# Altium schematic sheet CABLE_JIG_TEST_SCH.SchDoc
size 889 x 635 mm; SheetNumber: 1; SheetTotal: 1
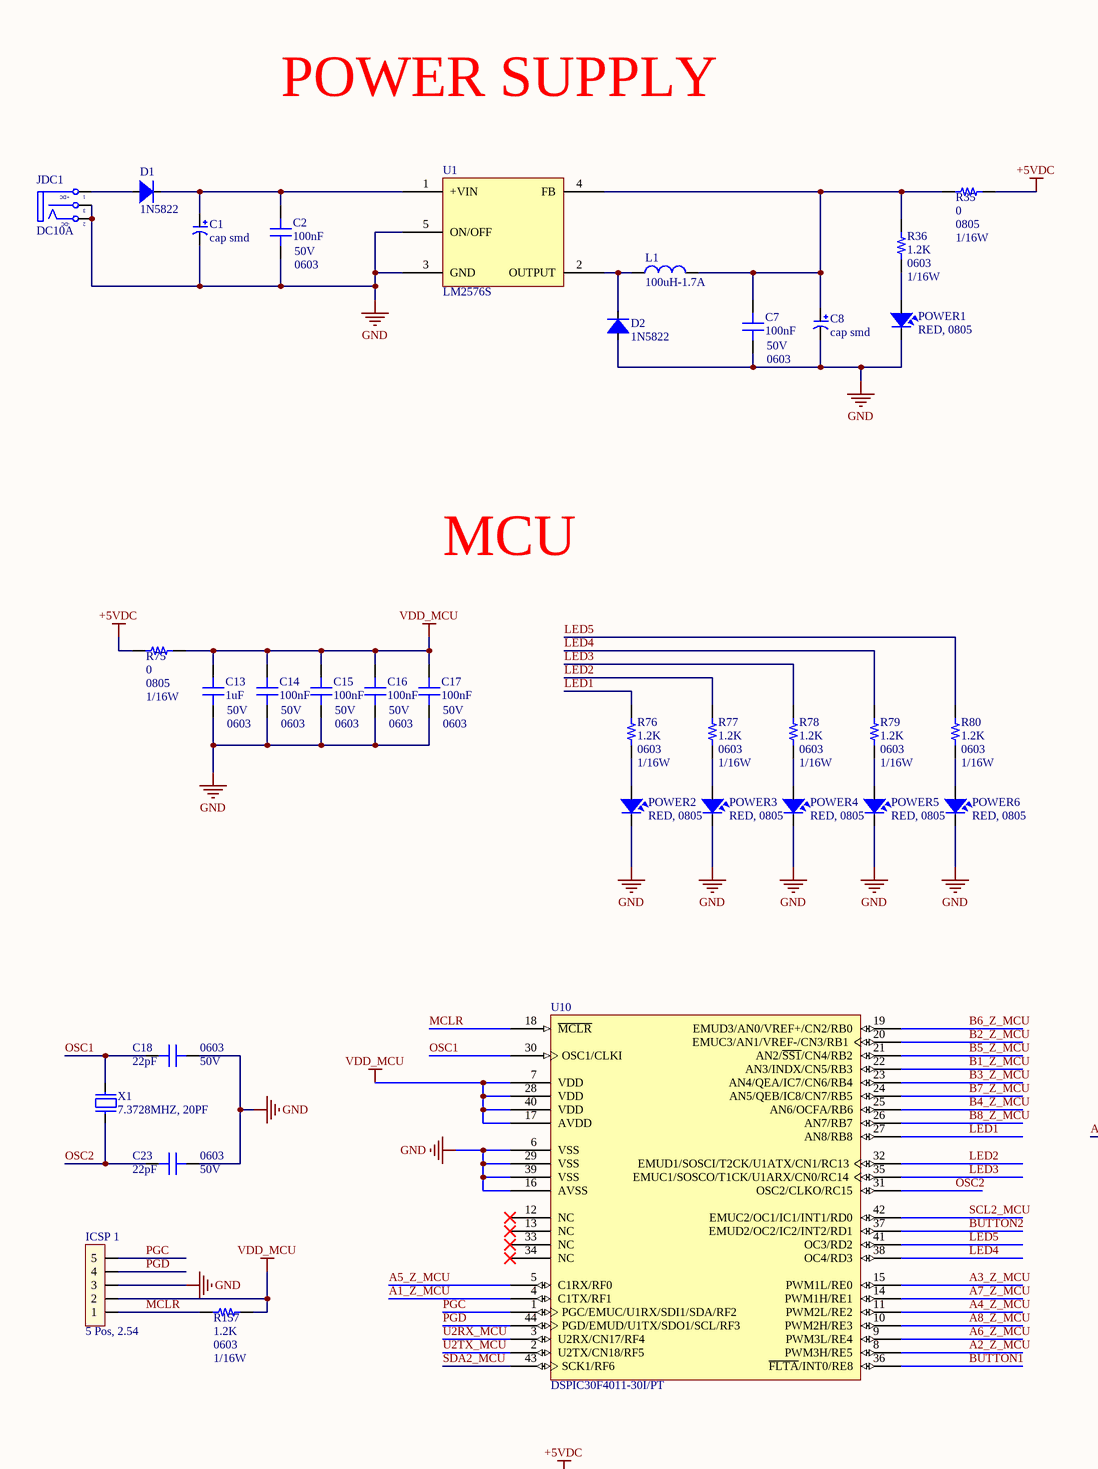
[diagram p0: CABLE_JIG_TEST_SCH.SchDoc, top left]
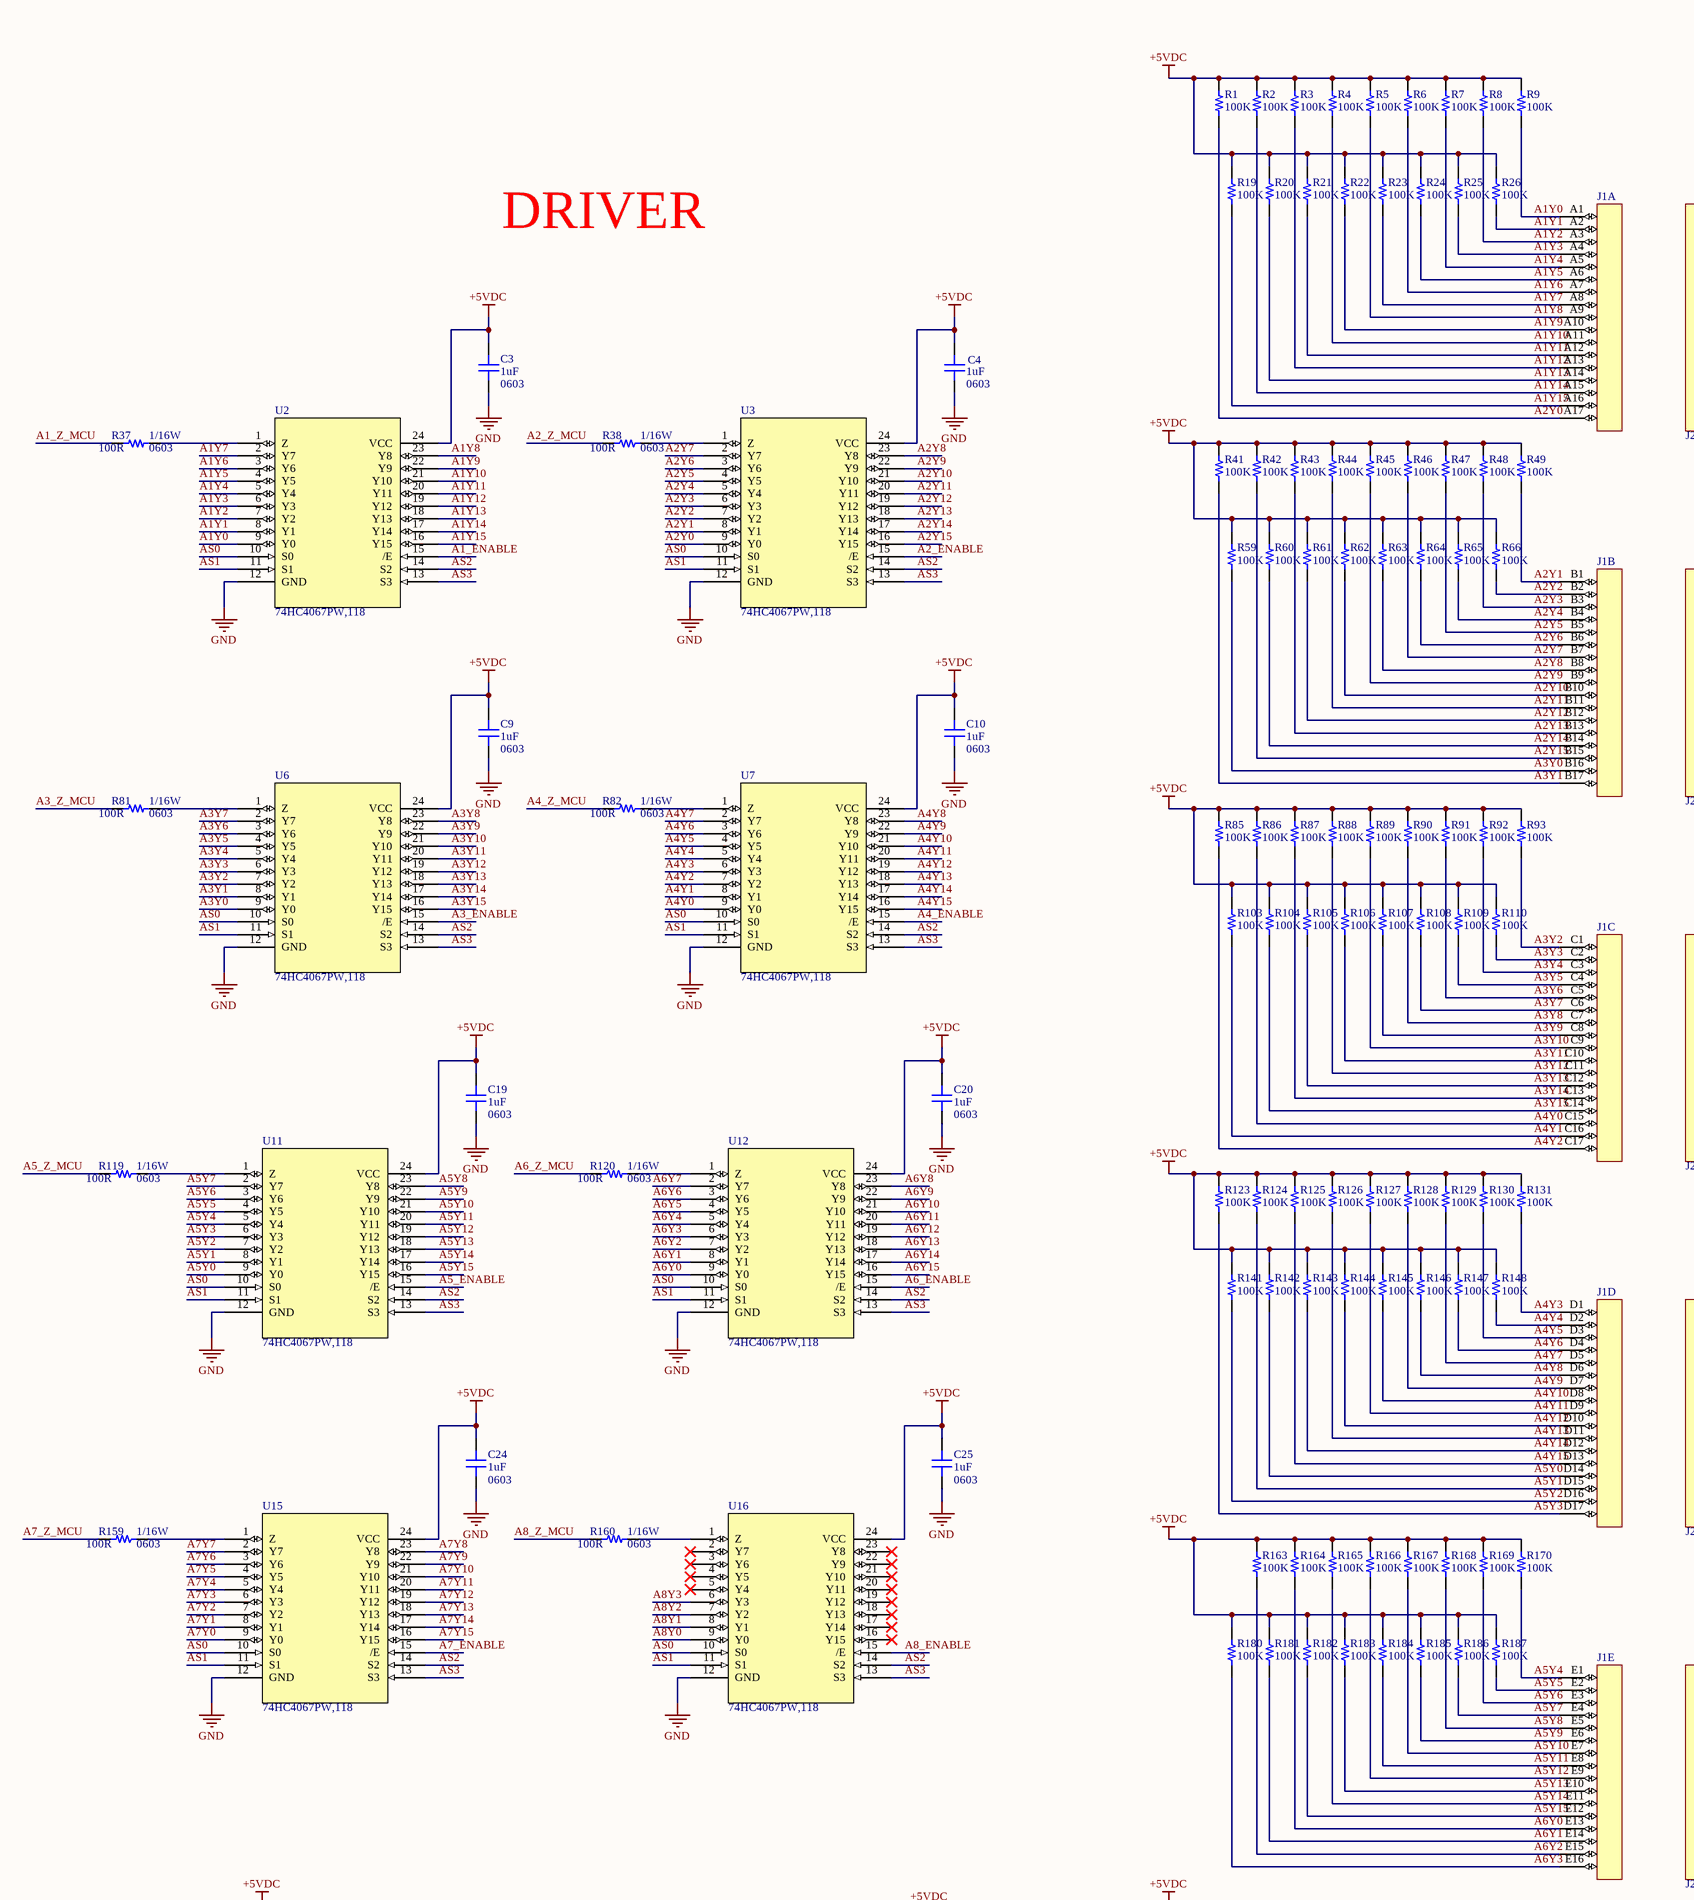
[diagram p1: CABLE_JIG_TEST_SCH.SchDoc, top middle]
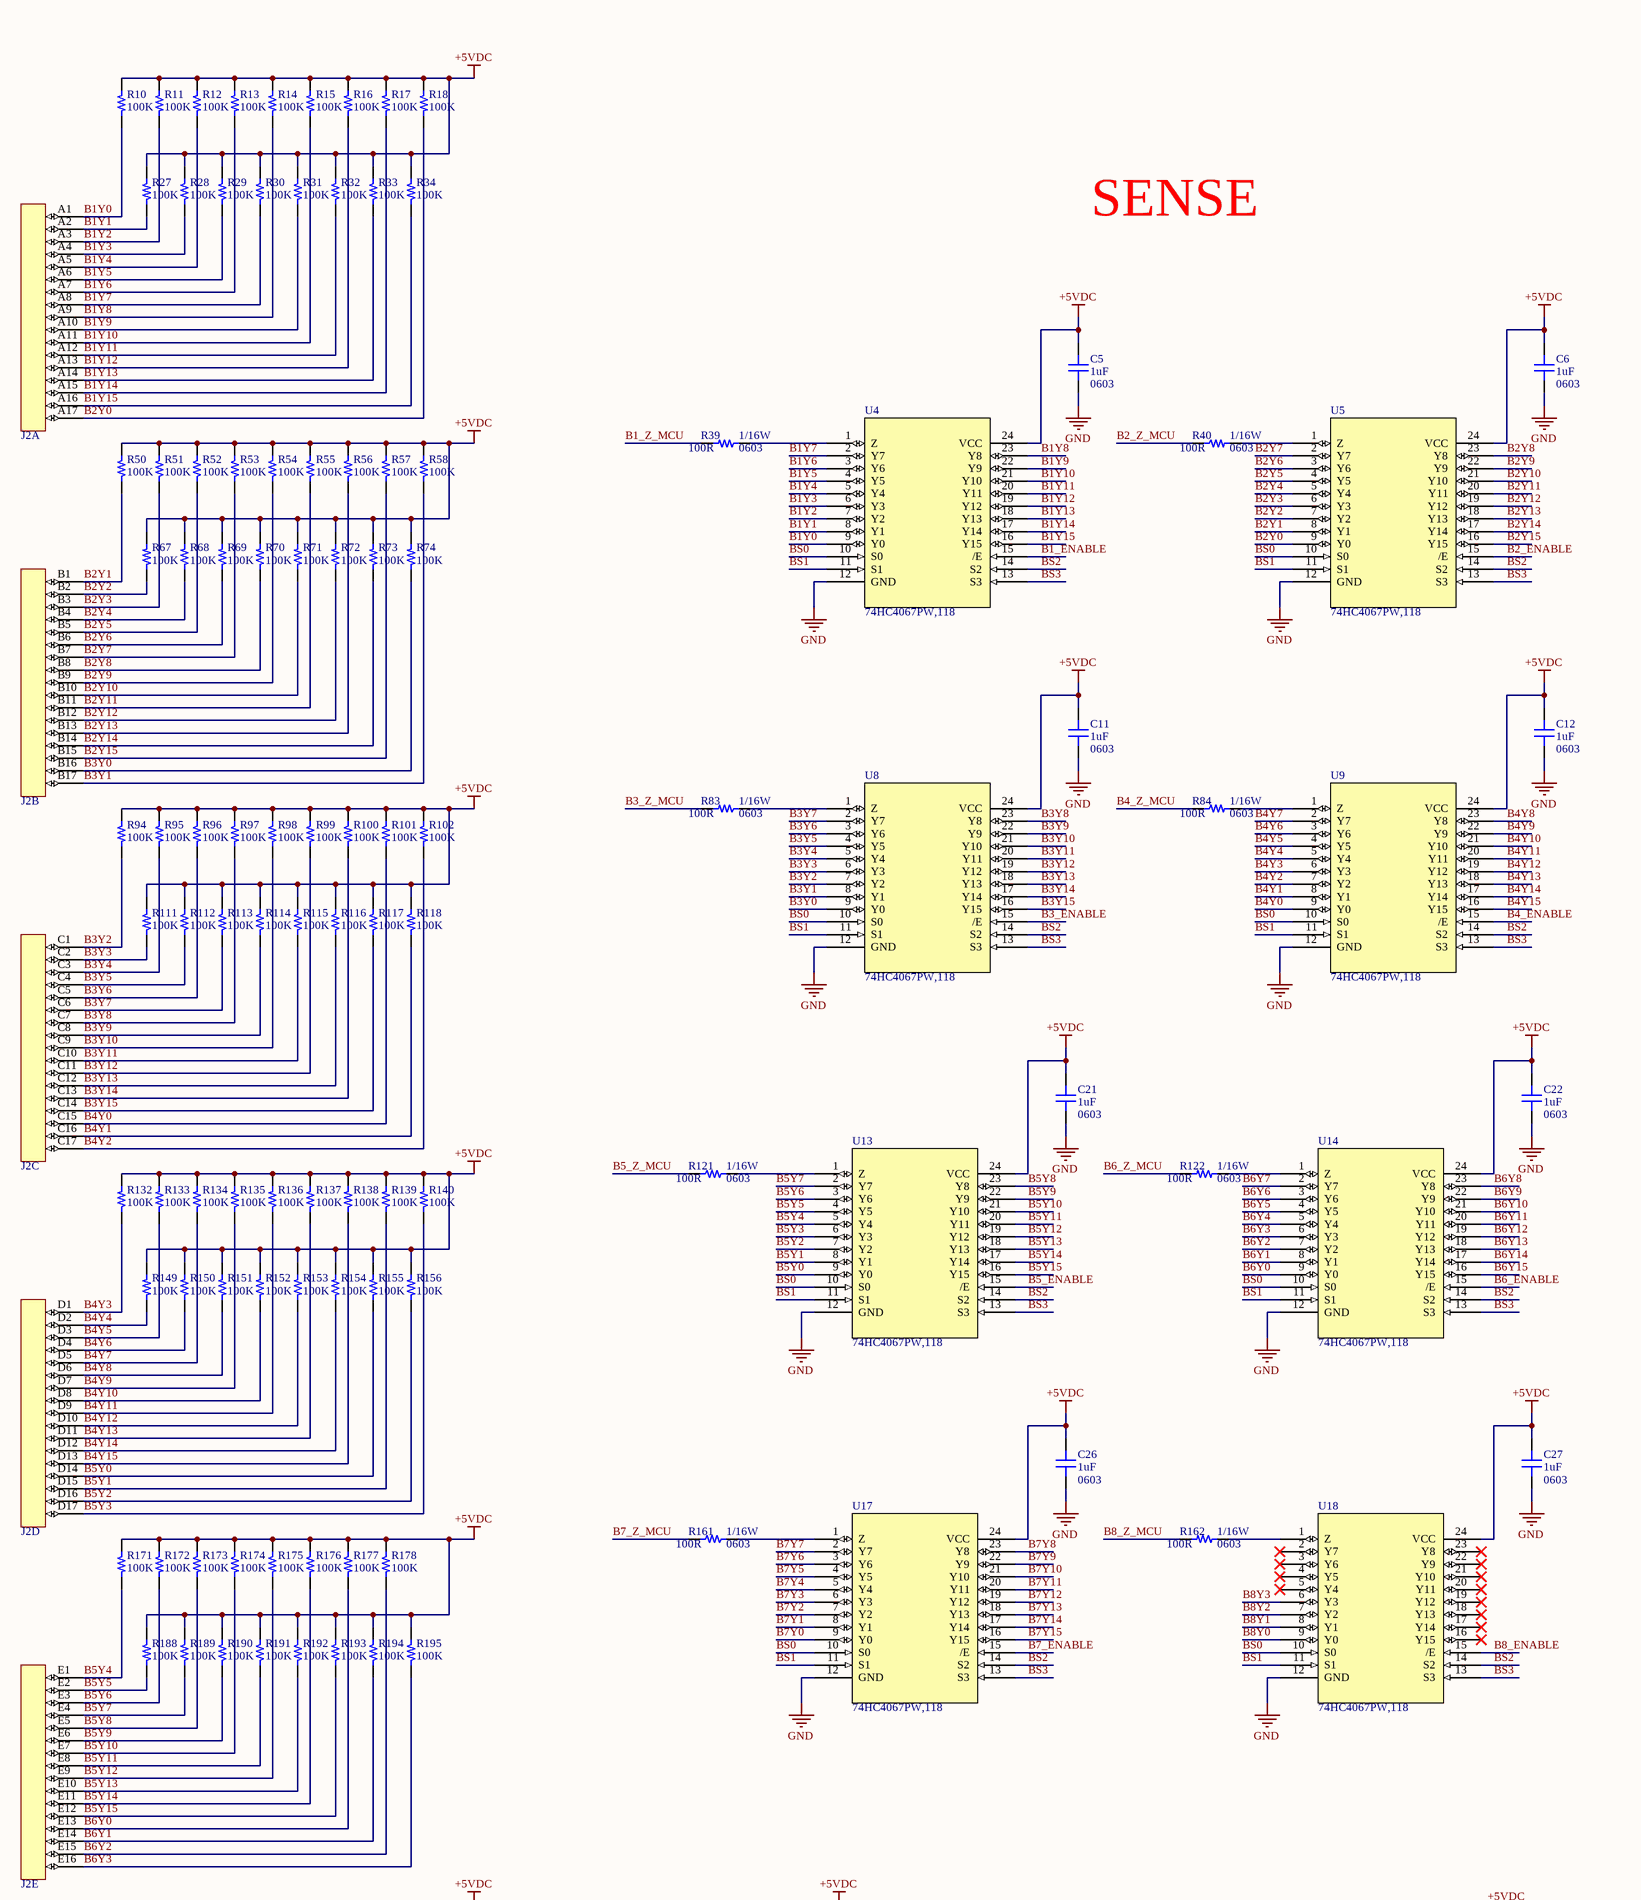
[diagram p2: CABLE_JIG_TEST_SCH.SchDoc, top right]
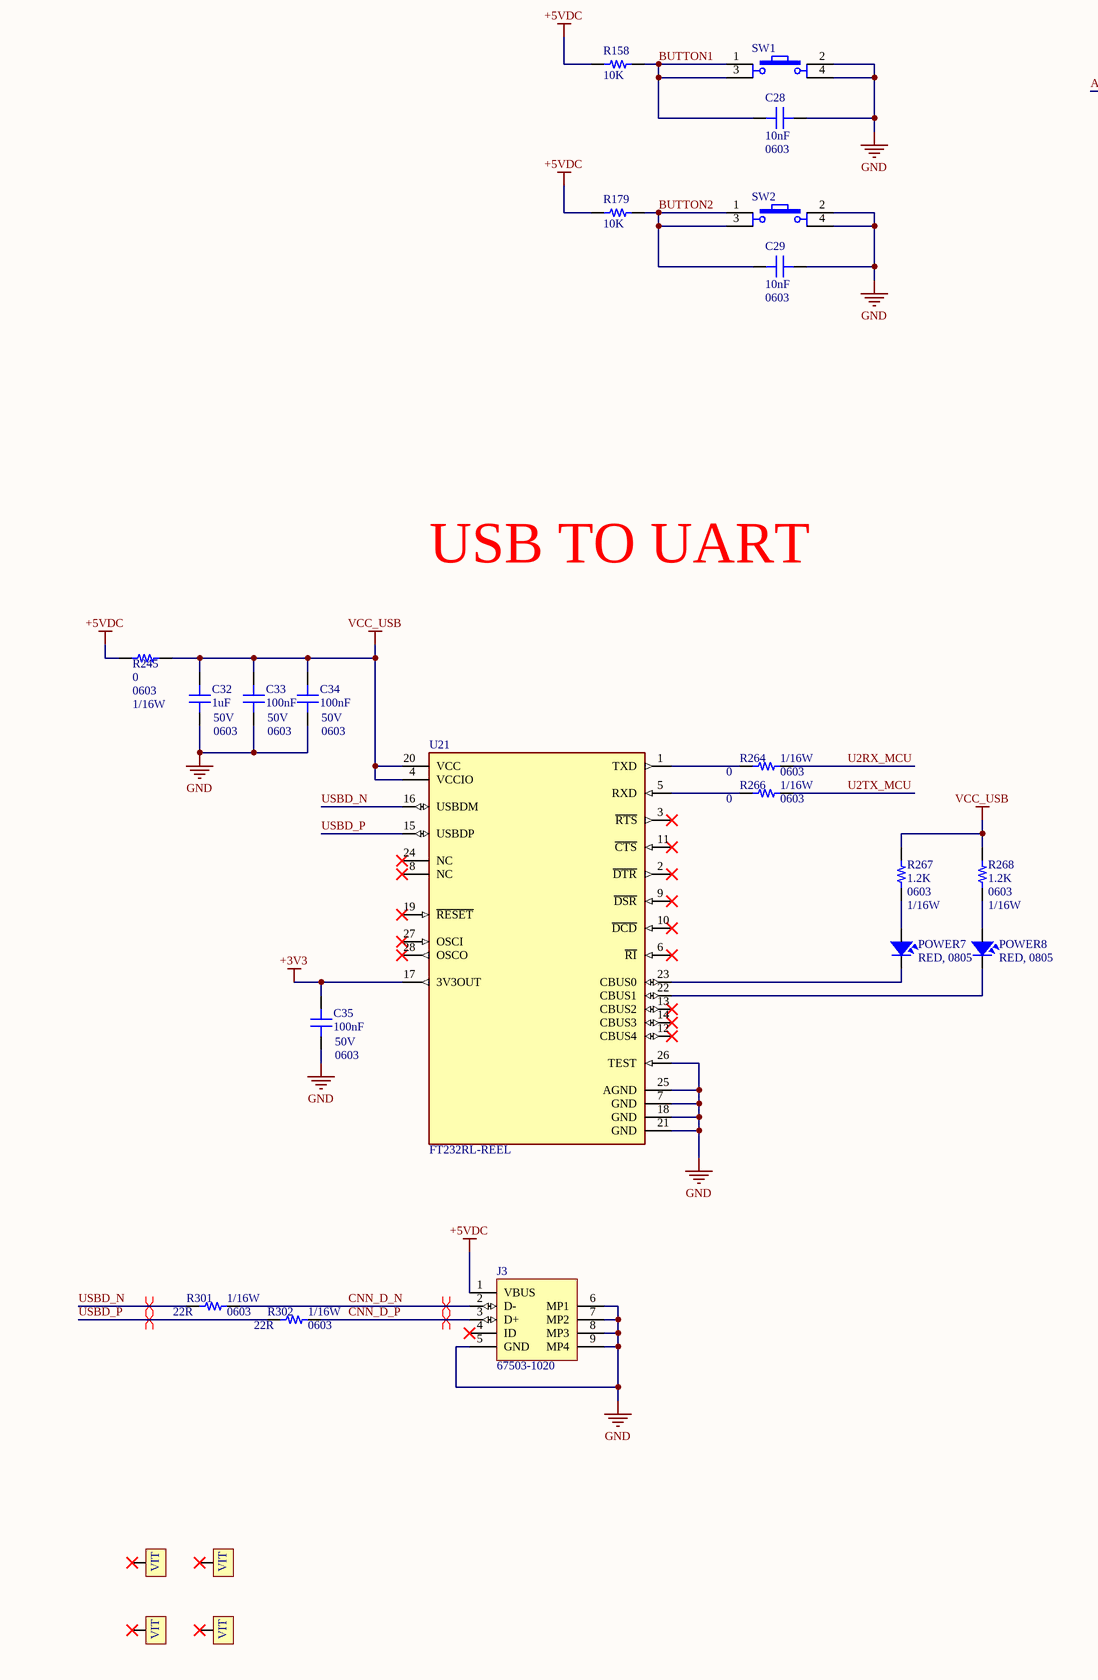
[diagram p3: CABLE_JIG_TEST_SCH.SchDoc, bottom left]
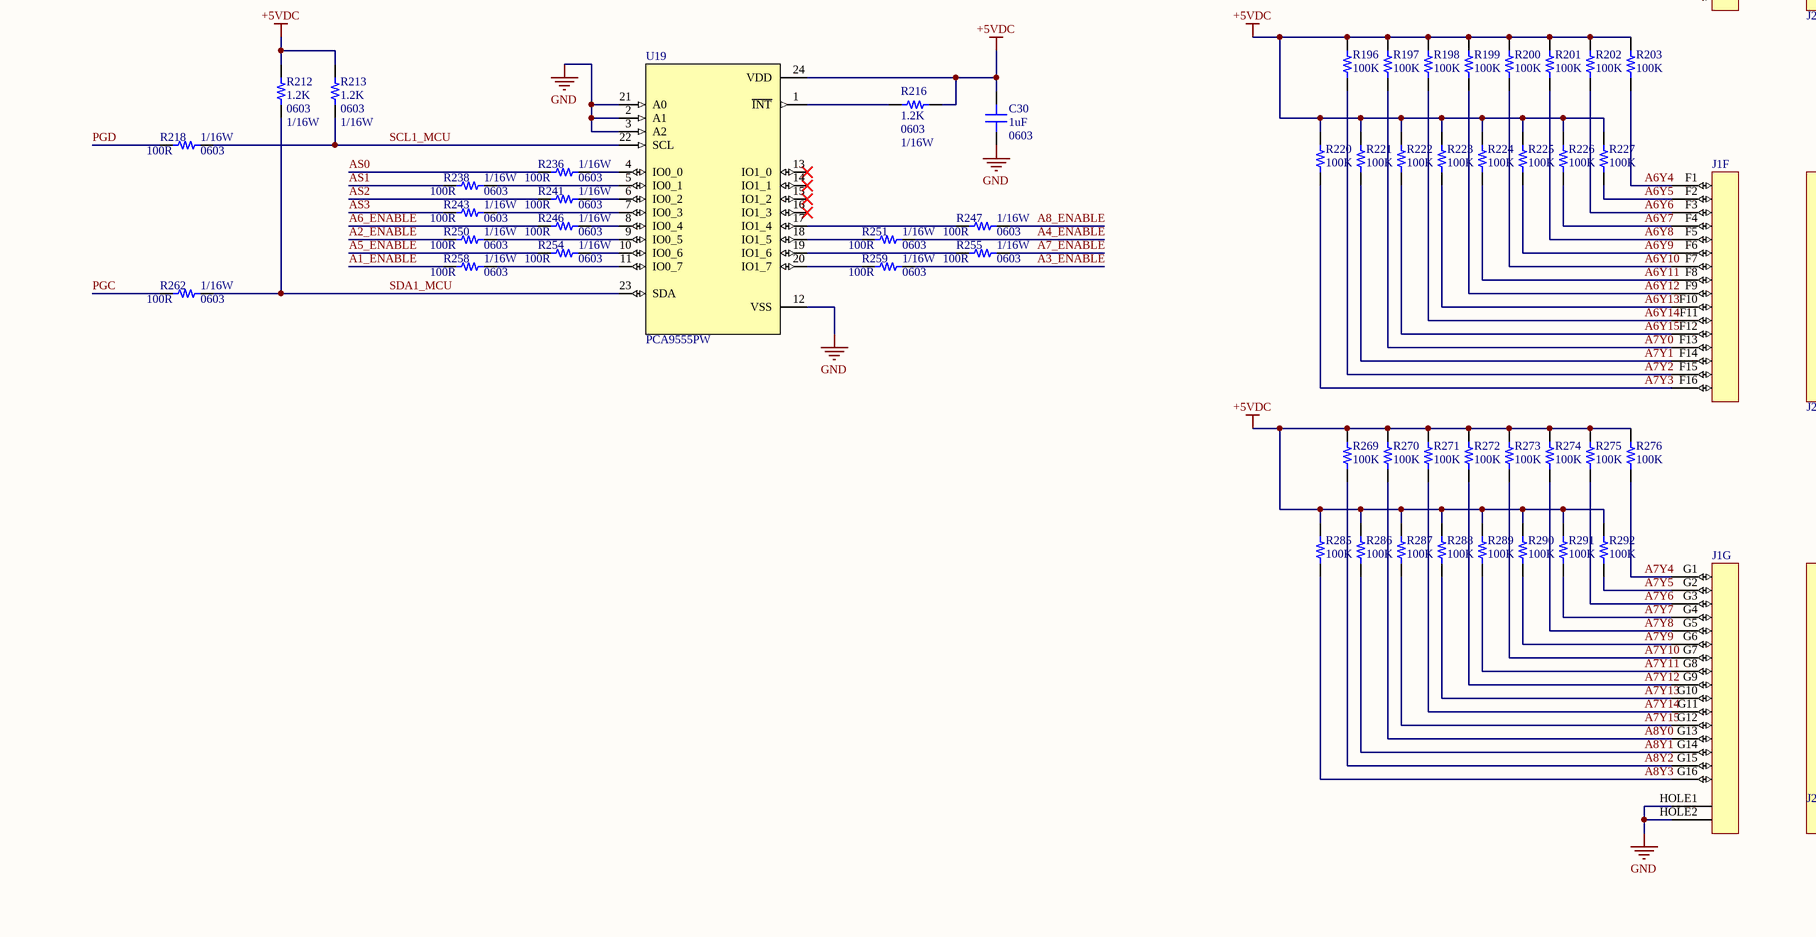
[diagram p4: CABLE_JIG_TEST_SCH.SchDoc, bottom middle]
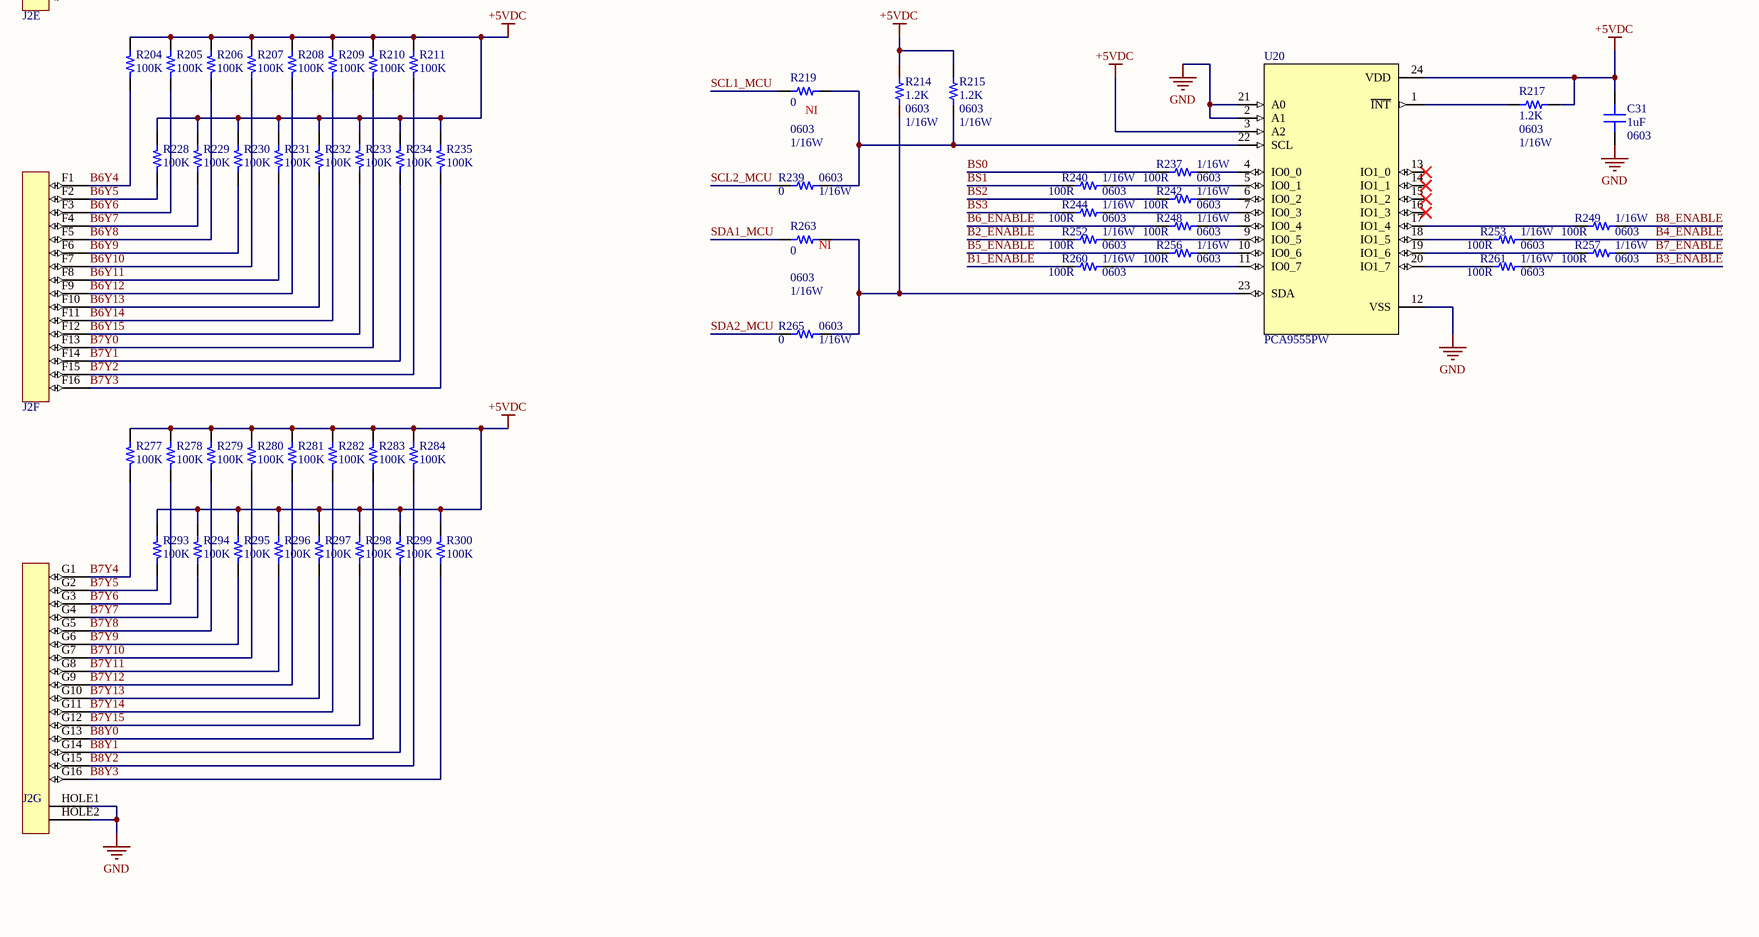
[diagram p5: CABLE_JIG_TEST_SCH.SchDoc, bottom right]

## Parts
C1  cap smd  [Cap_SMD_10x10.5mm]
C2  100nF  Package: 0603  Voltage: 50V  [C0603N]
C3  1uF  Package: 0603  [C0603N]
C4  1uF  Package: 0603  [C0603N]
C5  1uF  Package: 0603  [C0603N]
C6  1uF  Package: 0603  [C0603N]
C7  100nF  Package: 0603  Voltage: 50V  [C0603N]
C8  cap smd  [Cap_SMD_10x10.5mm]
C9  1uF  Package: 0603  [C0603N]
C10  1uF  Package: 0603  [C0603N]
C11  1uF  Package: 0603  [C0603N]
C12  1uF  Package: 0603  [C0603N]
C13  1uF  Package: 0603  Voltage: 50V  [C0603N]
C14  100nF  Package: 0603  Voltage: 50V  [C0603N]
C15  100nF  Package: 0603  Voltage: 50V  [C0603N]
C16  100nF  Package: 0603  Voltage: 50V  [C0603N]
C17  100nF  Package: 0603  Voltage: 50V  [C0603N]
C18  22pF  Package: 0603  Voltage: 50V  [C0603N]
C19  1uF  Package: 0603  [C0603N]
C20  1uF  Package: 0603  [C0603N]
C21  1uF  Package: 0603  [C0603N]
C22  1uF  Package: 0603  [C0603N]
C23  22pF  Package: 0603  Voltage: 50V  [C0603N]
C24  1uF  Package: 0603  [C0603N]
C25  1uF  Package: 0603  [C0603N]
C26  1uF  Package: 0603  [C0603N]
C27  1uF  Package: 0603  [C0603N]
C28  10nF  Package: 0603  [C0603N]
C29  10nF  Package: 0603  [C0603N]
C30  1uF  Package: 0603  [C0603N]
C31  1uF  Package: 0603  [C0603N]
C32  1uF  Package: 0603  Voltage: 50V  [C0603N]
C33  100nF  Package: 0603  Voltage: 50V  [C0603N]
C34  100nF  Package: 0603  Voltage: 50V  [C0603N]
C35  100nF  Package: 0603  Voltage: 50V  [C0603N]
D1  1N5822  [DO214 SMA]
D2  1N5822  [DO214 SMA]
ICSP_1  5 Pos, 2.54  [JP5]
J1  CNN_CABLE_116PINS  [CNN_CABLE_116PINS]  (value not drawn)  (parts A,B,C,D,E,F,G of 7)
J2  CNN_CABLE_116PINS  [CNN_CABLE_116PINS]  (value not drawn)  (parts A,B,C,D,E,F,G of 7)
J3  67503-1020  [MOLX-67503-1020_V]
JDC1  DC10A  [DC-IN]
L1  100uH-1.7A  [IND_SMD_12.5x12.5]
POWER1  RED, 0805  [LED 0805]
POWER2  RED, 0805  [LED 0805]
POWER3  RED, 0805  [LED 0805]
POWER4  RED, 0805  [LED 0805]
POWER5  RED, 0805  [LED 0805]
POWER6  RED, 0805  [LED 0805]
POWER7  RED, 0805  [LED 0805]
POWER8  RED, 0805  [LED 0805]
R1  100K  [R0603N]
R2  100K  [R0603N]
R3  100K  [R0603N]
R4  100K  [R0603N]
R5  100K  [R0603N]
R6  100K  [R0603N]
R7  100K  [R0603N]
R8  100K  [R0603N]
R9  100K  [R0603N]
R10  100K  [R0603N]
R11  100K  [R0603N]
R12  100K  [R0603N]
R13  100K  [R0603N]
R14  100K  [R0603N]
R15  100K  [R0603N]
R16  100K  [R0603N]
R17  100K  [R0603N]
R18  100K  [R0603N]
R19  100K  [R0603N]
R20  100K  [R0603N]
R21  100K  [R0603N]
R22  100K  [R0603N]
R23  100K  [R0603N]
R24  100K  [R0603N]
R25  100K  [R0603N]
R26  100K  [R0603N]
R27  100K  [R0603N]
R28  100K  [R0603N]
R29  100K  [R0603N]
R30  100K  [R0603N]
R31  100K  [R0603N]
R32  100K  [R0603N]
R33  100K  [R0603N]
R34  100K  [R0603N]
R35  0  Package: 0805  Power Rating: 1/16W  [R0805N]
R36  1.2K  Package: 0603  Power Rating: 1/16W  [R0603N]
R37  100R  Package: 0603  Power Rating: 1/16W  [R0603N]
R38  100R  Package: 0603  Power Rating: 1/16W  [R0603N]
R39  100R  Package: 0603  Power Rating: 1/16W  [R0603N]
R40  100R  Package: 0603  Power Rating: 1/16W  [R0603N]
R41  100K  [R0603N]
R42  100K  [R0603N]
R43  100K  [R0603N]
R44  100K  [R0603N]
R45  100K  [R0603N]
R46  100K  [R0603N]
R47  100K  [R0603N]
R48  100K  [R0603N]
R49  100K  [R0603N]
R50  100K  [R0603N]
R51  100K  [R0603N]
R52  100K  [R0603N]
R53  100K  [R0603N]
R54  100K  [R0603N]
R55  100K  [R0603N]
R56  100K  [R0603N]
R57  100K  [R0603N]
R58  100K  [R0603N]
R59  100K  [R0603N]
R60  100K  [R0603N]
R61  100K  [R0603N]
R62  100K  [R0603N]
R63  100K  [R0603N]
R64  100K  [R0603N]
R65  100K  [R0603N]
R66  100K  [R0603N]
R67  100K  [R0603N]
R68  100K  [R0603N]
R69  100K  [R0603N]
R70  100K  [R0603N]
R71  100K  [R0603N]
R72  100K  [R0603N]
R73  100K  [R0603N]
R74  100K  [R0603N]
R75  0  Package: 0805  Power Rating: 1/16W  [R0805N]
R76  1.2K  Package: 0603  Power Rating: 1/16W  [R0603N]
R77  1.2K  Package: 0603  Power Rating: 1/16W  [R0603N]
R78  1.2K  Package: 0603  Power Rating: 1/16W  [R0603N]
R79  1.2K  Package: 0603  Power Rating: 1/16W  [R0603N]
R80  1.2K  Package: 0603  Power Rating: 1/16W  [R0603N]
R81  100R  Package: 0603  Power Rating: 1/16W  [R0603N]
R82  100R  Package: 0603  Power Rating: 1/16W  [R0603N]
R83  100R  Package: 0603  Power Rating: 1/16W  [R0603N]
R84  100R  Package: 0603  Power Rating: 1/16W  [R0603N]
R85  100K  [R0603N]
R86  100K  [R0603N]
R87  100K  [R0603N]
R88  100K  [R0603N]
R89  100K  [R0603N]
R90  100K  [R0603N]
R91  100K  [R0603N]
R92  100K  [R0603N]
R93  100K  [R0603N]
R94  100K  [R0603N]
R95  100K  [R0603N]
R96  100K  [R0603N]
R97  100K  [R0603N]
R98  100K  [R0603N]
R99  100K  [R0603N]
R100  100K  [R0603N]
R101  100K  [R0603N]
R102  100K  [R0603N]
R103  100K  [R0603N]
R104  100K  [R0603N]
R105  100K  [R0603N]
R106  100K  [R0603N]
R107  100K  [R0603N]
R108  100K  [R0603N]
R109  100K  [R0603N]
R110  100K  [R0603N]
R111  100K  [R0603N]
R112  100K  [R0603N]
R113  100K  [R0603N]
R114  100K  [R0603N]
R115  100K  [R0603N]
R116  100K  [R0603N]
R117  100K  [R0603N]
R118  100K  [R0603N]
R119  100R  Package: 0603  Power Rating: 1/16W  [R0603N]
R120  100R  Package: 0603  Power Rating: 1/16W  [R0603N]
R121  100R  Package: 0603  Power Rating: 1/16W  [R0603N]
R122  100R  Package: 0603  Power Rating: 1/16W  [R0603N]
R123  100K  [R0603N]
R124  100K  [R0603N]
R125  100K  [R0603N]
R126  100K  [R0603N]
R127  100K  [R0603N]
R128  100K  [R0603N]
R129  100K  [R0603N]
R130  100K  [R0603N]
R131  100K  [R0603N]
R132  100K  [R0603N]
R133  100K  [R0603N]
R134  100K  [R0603N]
R135  100K  [R0603N]
R136  100K  [R0603N]
R137  100K  [R0603N]
R138  100K  [R0603N]
R139  100K  [R0603N]
R140  100K  [R0603N]
R141  100K  [R0603N]
R142  100K  [R0603N]
R143  100K  [R0603N]
R144  100K  [R0603N]
R145  100K  [R0603N]
R146  100K  [R0603N]
R147  100K  [R0603N]
R148  100K  [R0603N]
R149  100K  [R0603N]
R150  100K  [R0603N]
R151  100K  [R0603N]
R152  100K  [R0603N]
R153  100K  [R0603N]
R154  100K  [R0603N]
R155  100K  [R0603N]
R156  100K  [R0603N]
R157  1.2K  Package: 0603  Power Rating: 1/16W  [R0603N]
R158  10K  [R0603N]
R159  100R  Package: 0603  Power Rating: 1/16W  [R0603N]
R160  100R  Package: 0603  Power Rating: 1/16W  [R0603N]
R161  100R  Package: 0603  Power Rating: 1/16W  [R0603N]
R162  100R  Package: 0603  Power Rating: 1/16W  [R0603N]
R163  100K  [R0603N]
R164  100K  [R0603N]
R165  100K  [R0603N]
R166  100K  [R0603N]
R167  100K  [R0603N]
R168  100K  [R0603N]
R169  100K  [R0603N]
R170  100K  [R0603N]
R171  100K  [R0603N]
R172  100K  [R0603N]
R173  100K  [R0603N]
R174  100K  [R0603N]
R175  100K  [R0603N]
R176  100K  [R0603N]
R177  100K  [R0603N]
R178  100K  [R0603N]
R179  10K  [R0603N]
R180  100K  [R0603N]
R181  100K  [R0603N]
R182  100K  [R0603N]
R183  100K  [R0603N]
R184  100K  [R0603N]
R185  100K  [R0603N]
R186  100K  [R0603N]
R187  100K  [R0603N]
R188  100K  [R0603N]
R189  100K  [R0603N]
R190  100K  [R0603N]
R191  100K  [R0603N]
R192  100K  [R0603N]
R193  100K  [R0603N]
R194  100K  [R0603N]
R195  100K  [R0603N]
R196  100K  [R0603N]
R197  100K  [R0603N]
R198  100K  [R0603N]
R199  100K  [R0603N]
R200  100K  [R0603N]
R201  100K  [R0603N]
R202  100K  [R0603N]
R203  100K  [R0603N]
R204  100K  [R0603N]
R205  100K  [R0603N]
R206  100K  [R0603N]
R207  100K  [R0603N]
R208  100K  [R0603N]
R209  100K  [R0603N]
R210  100K  [R0603N]
R211  100K  [R0603N]
R212  1.2K  Package: 0603  Power Rating: 1/16W  [R0603N]
R213  1.2K  Package: 0603  Power Rating: 1/16W  [R0603N]
R214  1.2K  Package: 0603  Power Rating: 1/16W  [R0603N]
R215  1.2K  Package: 0603  Power Rating: 1/16W  [R0603N]
R216  1.2K  Package: 0603  Power Rating: 1/16W  [R0603N]
R217  1.2K  Package: 0603  Power Rating: 1/16W  [R0603N]
R218  100R  Package: 0603  Power Rating: 1/16W  [R0603N]
R219  0  NI_MARK: NI  Package: 0603  Power Rating: 1/16W  [R0603N]
R220  100K  [R0603N]
R221  100K  [R0603N]
R222  100K  [R0603N]
R223  100K  [R0603N]
R224  100K  [R0603N]
R225  100K  [R0603N]
R226  100K  [R0603N]
R227  100K  [R0603N]
R228  100K  [R0603N]
R229  100K  [R0603N]
R230  100K  [R0603N]
R231  100K  [R0603N]
R232  100K  [R0603N]
R233  100K  [R0603N]
R234  100K  [R0603N]
R235  100K  [R0603N]
R236  100R  Package: 0603  Power Rating: 1/16W  [R0603N]
R237  100R  Package: 0603  Power Rating: 1/16W  [R0603N]
R238  100R  Package: 0603  Power Rating: 1/16W  [R0603N]
R239  0  Package: 0603  Power Rating: 1/16W  [R0603N]
R240  100R  Package: 0603  Power Rating: 1/16W  [R0603N]
R241  100R  Package: 0603  Power Rating: 1/16W  [R0603N]
R242  100R  Package: 0603  Power Rating: 1/16W  [R0603N]
R243  100R  Package: 0603  Power Rating: 1/16W  [R0603N]
R244  100R  Package: 0603  Power Rating: 1/16W  [R0603N]
R245  0  Package: 0603  Power Rating: 1/16W  [R0603N]
R246  100R  Package: 0603  Power Rating: 1/16W  [R0603N]
R247  100R  Package: 0603  Power Rating: 1/16W  [R0603N]
R248  100R  Package: 0603  Power Rating: 1/16W  [R0603N]
R249  100R  Package: 0603  Power Rating: 1/16W  [R0603N]
R250  100R  Package: 0603  Power Rating: 1/16W  [R0603N]
R251  100R  Package: 0603  Power Rating: 1/16W  [R0603N]
R252  100R  Package: 0603  Power Rating: 1/16W  [R0603N]
R253  100R  Package: 0603  Power Rating: 1/16W  [R0603N]
R254  100R  Package: 0603  Power Rating: 1/16W  [R0603N]
R255  100R  Package: 0603  Power Rating: 1/16W  [R0603N]
R256  100R  Package: 0603  Power Rating: 1/16W  [R0603N]
R257  100R  Package: 0603  Power Rating: 1/16W  [R0603N]
R258  100R  Package: 0603  Power Rating: 1/16W  [R0603N]
R259  100R  Package: 0603  Power Rating: 1/16W  [R0603N]
R260  100R  Package: 0603  Power Rating: 1/16W  [R0603N]
R261  100R  Package: 0603  Power Rating: 1/16W  [R0603N]
R262  100R  Package: 0603  Power Rating: 1/16W  [R0603N]
R263  0  NI_MARK: NI  Package: 0603  Power Rating: 1/16W  [R0603N]
R264  0  Package: 0603  Power Rating: 1/16W  [R0603N]
R265  0  Package: 0603  Power Rating: 1/16W  [R0603N]
R266  0  Package: 0603  Power Rating: 1/16W  [R0603N]
R267  1.2K  Package: 0603  Power Rating: 1/16W  [R0603N]
R268  1.2K  Package: 0603  Power Rating: 1/16W  [R0603N]
R269  100K  [R0603N]
R270  100K  [R0603N]
R271  100K  [R0603N]
R272  100K  [R0603N]
R273  100K  [R0603N]
R274  100K  [R0603N]
R275  100K  [R0603N]
R276  100K  [R0603N]
R277  100K  [R0603N]
R278  100K  [R0603N]
R279  100K  [R0603N]
R280  100K  [R0603N]
R281  100K  [R0603N]
R282  100K  [R0603N]
R283  100K  [R0603N]
R284  100K  [R0603N]
R285  100K  [R0603N]
R286  100K  [R0603N]
R287  100K  [R0603N]
R288  100K  [R0603N]
R289  100K  [R0603N]
R290  100K  [R0603N]
R291  100K  [R0603N]
R292  100K  [R0603N]
R293  100K  [R0603N]
R294  100K  [R0603N]
R295  100K  [R0603N]
R296  100K  [R0603N]
R297  100K  [R0603N]
R298  100K  [R0603N]
R299  100K  [R0603N]
R300  100K  [R0603N]
R301  22R  Package: 0603  Power Rating: 1/16W  [R0603N]
R302  22R  Package: 0603  Power Rating: 1/16W  [R0603N]
SW1  SW  [SW4]  (value not drawn)
SW2  SW  [SW4]  (value not drawn)
U1  LM2576S  [TO263-5]
U2  74HC4067PW,118  [TSSOP24_SOT355-1_NEX-M]
U3  74HC4067PW,118  [TSSOP24_SOT355-1_NEX-M]
U4  74HC4067PW,118  [TSSOP24_SOT355-1_NEX-M]
U5  74HC4067PW,118  [TSSOP24_SOT355-1_NEX-M]
U6  74HC4067PW,118  [TSSOP24_SOT355-1_NEX-M]
U7  74HC4067PW,118  [TSSOP24_SOT355-1_NEX-M]
U8  74HC4067PW,118  [TSSOP24_SOT355-1_NEX-M]
U9  74HC4067PW,118  [TSSOP24_SOT355-1_NEX-M]
U10  DSPIC30F4011-30I/PT  [TQFP44_MC_MCH-M]
U11  74HC4067PW,118  [TSSOP24_SOT355-1_NEX-M]
U12  74HC4067PW,118  [TSSOP24_SOT355-1_NEX-M]
U13  74HC4067PW,118  [TSSOP24_SOT355-1_NEX-M]
U14  74HC4067PW,118  [TSSOP24_SOT355-1_NEX-M]
U15  74HC4067PW,118  [TSSOP24_SOT355-1_NEX-M]
U16  74HC4067PW,118  [TSSOP24_SOT355-1_NEX-M]
U17  74HC4067PW,118  [TSSOP24_SOT355-1_NEX-M]
U18  74HC4067PW,118  [TSSOP24_SOT355-1_NEX-M]
U19  PCA9555PW  [SOP65P640X120-24N]
U20  PCA9555PW  [SOP65P640X120-24N]
U21  FT232RL-REEL  [FP-SSOP-28-MFG]
VIT1  1  [VIT]  (value not drawn)
VIT2  1  [VIT]  (value not drawn)
VIT3  1  [VIT]  (value not drawn)
VIT4  1  [VIT]  (value not drawn)
X1  7.3728MHZ, 20PF  [XT2]

## Nets
+3V3: C35.1 U21.17(3V3OUT)
+5VDC: C3.1 C4.1 C5.1 C6.1 C9.1 C10.1 C11.1 C12.1 C19.1 C20.1 C21.1 C22.1 C24.1 C25.1 C26.1 C27.1 C30.1 C31.1 J3.1(VBUS) R1.2 R2.2 R3.2 R4.2 R5.2 R6.2 R7.2 R8.2 R9.2 R10.2 R11.2 R12.2 R13.2 R14.2 R15.2 R16.2 R17.2 R18.2 R19.2 R20.2 R21.2 R22.2 R23.2 R24.2 R25.2 R26.2 R27.2 R28.2 R29.2 R30.2 R31.2 R32.2 R33.2 R34.2 R35.1 R41.2 R42.2 R43.2 R44.2 R45.2 R46.2 R47.2 R48.2 R49.2 R50.2 R51.2 R52.2 R53.2 R54.2 R55.2 R56.2 R57.2 R58.2 R59.2 R60.2 R61.2 R62.2 R63.2 R64.2 R65.2 R66.2 R67.2 R68.2 R69.2 R70.2 R71.2 R72.2 R73.2 R74.2 R75.2 R85.2 R86.2 R87.2 R88.2 R89.2 R90.2 R91.2 R92.2 R93.2 R94.2 R95.2 R96.2 R97.2 R98.2 R99.2 R100.2 R101.2 R102.2 R103.2 R104.2 R105.2 R106.2 R107.2 R108.2 R109.2 R110.2 R111.2 R112.2 R113.2 R114.2 R115.2 R116.2 R117.2 R118.2 R123.2 R124.2 R125.2 R126.2 R127.2 R128.2 R129.2 R130.2 R131.2 R132.2 R133.2 R134.2 R135.2 R136.2 R137.2 R138.2 R139.2 R140.2 R141.2 R142.2 R143.2 R144.2 R145.2 R146.2 R147.2 R148.2 R149.2 R150.2 R151.2 R152.2 R153.2 R154.2 R155.2 R156.2 R158.2 R163.2 R164.2 R165.2 R166.2 R167.2 R168.2 R169.2 R170.2 R171.2 R172.2 R173.2 R174.2 R175.2 R176.2 R177.2 R178.2 R179.2 R180.2 R181.2 R182.2 R183.2 R184.2 R185.2 R186.2 R187.2 R188.2 R189.2 R190.2 R191.2 R192.2 R193.2 R194.2 R195.2 R196.2 R197.2 R198.2 R199.2 R200.2 R201.2 R202.2 R203.2 R204.2 R205.2 R206.2 R207.2 R208.2 R209.2 R210.2 R211.2 R212.1 R213.1 R214.1 R215.1 R216.2 R217.2 R220.2 R221.2 R222.2 R223.2 R224.2 R225.2 R226.2 R227.2 R228.2 R229.2 R230.2 R231.2 R232.2 R233.2 R234.2 R235.2 R245.2 R269.2 R270.2 R271.2 R272.2 R273.2 R274.2 R275.2 R276.2 R277.2 R278.2 R279.2 R280.2 R281.2 R282.2 R283.2 R284.2 R285.2 R286.2 R287.2 R288.2 R289.2 R290.2 R291.2 R292.2 R293.2 R294.2 R295.2 R296.2 R297.2 R298.2 R299.2 R300.2 U2.24(VCC) U3.24(VCC) U4.24(VCC) U5.24(VCC) U6.24(VCC) U7.24(VCC) U8.24(VCC) U9.24(VCC) U11.24(VCC) U12.24(VCC) U13.24(VCC) U14.24(VCC) U15.24(VCC) U16.24(VCC) U17.24(VCC) U18.24(VCC) U19.24(VDD) U20.3(A2) U20.24(VDD)
GND: C1.2 C2.2 C3.2 C4.2 C5.2 C6.2 C7.2 C8.2 C9.2 C10.2 C11.2 C12.2 C13.2 C14.2 C15.2 C16.2 C17.2 C18.2 C19.2 C20.2 C21.2 C22.2 C23.2 C24.2 C25.2 C26.2 C27.2 C28.2 C29.2 C30.2 C31.2 C32.2 C33.2 C34.2 C35.2 D2.A ICSP_1.3 J1.HOLE1 J1.HOLE2 J2.HOLE1 J2.HOLE2 J3.5(GND) J3.6(MP1) J3.7(MP2) J3.8(MP3) J3.9(MP4) JDC1.2(TN) JDC1.3(S) POWER1.1 POWER2.1 POWER3.1 POWER4.1 POWER5.1 POWER6.1 SW1.2 SW1.4 SW2.2 SW2.4 U1.3(GND) U1.5(ON/OFF) U2.12(GND) U3.12(GND) U4.12(GND) U5.12(GND) U6.12(GND) U7.12(GND) U8.12(GND) U9.12(GND) U10.6(VSS) U10.16(AVSS) U10.29(VSS) U10.39(VSS) U11.12(GND) U12.12(GND) U13.12(GND) U14.12(GND) U15.12(GND) U16.12(GND) U17.12(GND) U18.12(GND) U19.2(A1) U19.3(A2) U19.12(VSS) U19.21(A0) U20.2(A1) U20.12(VSS) U20.21(A0) U21.7(GND) U21.18(GND) U21.21(GND) U21.25(AGND) U21.26(TEST)
VCC_USB: C32.1 C33.1 C34.1 R245.1 R267.2 R268.2 U21.4(VCCIO) U21.20(VCC)
VDD_MCU: C13.1 C14.1 C15.1 C16.1 C17.1 ICSP_1.2 R75.1 R157.1 U10.7(VDD) U10.17(AVDD) U10.28(VDD) U10.40(VDD)
A1_ENABLE: R258.1 U2.15(/E)
A1_Z_MCU: R37.1 U10.4(C1TX/RF1)
A1Y0: J1.A1 R9.1 U2.9(Y0)
A1Y1: J1.A2 R26.1 U2.8(Y1)
A1Y2: J1.A3 R8.1 U2.7(Y2)
A1Y3: J1.A4 R25.1 U2.6(Y3)
A1Y4: J1.A5 R7.1 U2.5(Y4)
A1Y5: J1.A6 R24.1 U2.4(Y5)
A1Y6: J1.A7 R6.1 U2.3(Y6)
A1Y7: J1.A8 R23.1 U2.2(Y7)
A1Y8: J1.A9 R5.1 U2.23(Y8)
A1Y9: J1.A10 R22.1 U2.22(Y9)
A1Y10: J1.A11 R4.1 U2.21(Y10)
A1Y11: J1.A12 R21.1 U2.20(Y11)
A1Y12: J1.A13 R3.1 U2.19(Y12)
A1Y13: J1.A14 R20.1 U2.18(Y13)
A1Y14: J1.A15 R2.1 U2.17(Y14)
A1Y15: J1.A16 R19.1 U2.16(Y15)
A2_ENABLE: R250.1 U3.15(/E)
A2_Z_MCU: R38.1 U10.8(PWM3H/RE5)
A2Y0: J1.A17 R1.1 U3.9(Y0)
A2Y1: J1.B1 R49.1 U3.8(Y1)
A2Y2: J1.B2 R66.1 U3.7(Y2)
A2Y3: J1.B3 R48.1 U3.6(Y3)
A2Y4: J1.B4 R65.1 U3.5(Y4)
A2Y5: J1.B5 R47.1 U3.4(Y5)
A2Y6: J1.B6 R64.1 U3.3(Y6)
A2Y7: J1.B7 R46.1 U3.2(Y7)
A2Y8: J1.B8 R63.1 U3.23(Y8)
A2Y9: J1.B9 R45.1 U3.22(Y9)
A2Y10: J1.B10 R62.1 U3.21(Y10)
A2Y11: J1.B11 R44.1 U3.20(Y11)
A2Y12: J1.B12 R61.1 U3.19(Y12)
A2Y13: J1.B13 R43.1 U3.18(Y13)
A2Y14: J1.B14 R60.1 U3.17(Y14)
A2Y15: J1.B15 R42.1 U3.16(Y15)
A3_ENABLE: R259.2 U6.15(/E)
A3_Z_MCU: R81.1 U10.15(PWM1L/RE0)
A3Y0: J1.B16 R59.1 U6.9(Y0)
A3Y1: J1.B17 R41.1 U6.8(Y1)
A3Y2: J1.C1 R93.1 U6.7(Y2)
A3Y3: J1.C2 R110.1 U6.6(Y3)
A3Y4: J1.C3 R92.1 U6.5(Y4)
A3Y5: J1.C4 R109.1 U6.4(Y5)
A3Y6: J1.C5 R91.1 U6.3(Y6)
A3Y7: J1.C6 R108.1 U6.2(Y7)
A3Y8: J1.C7 R90.1 U6.23(Y8)
A3Y9: J1.C8 R107.1 U6.22(Y9)
A3Y10: J1.C9 R89.1 U6.21(Y10)
A3Y11: J1.C10 R106.1 U6.20(Y11)
A3Y12: J1.C11 R88.1 U6.19(Y12)
A3Y13: J1.C12 R105.1 U6.18(Y13)
A3Y14: J1.C13 R87.1 U6.17(Y14)
A3Y15: J1.C14 R104.1 U6.16(Y15)
A4_ENABLE: R251.2 U7.15(/E)
A4_Z_MCU: R82.1 U10.11(PWM2L/RE2)
A4Y0: J1.C15 R86.1 U7.9(Y0)
A4Y1: J1.C16 R103.1 U7.8(Y1)
A4Y2: J1.C17 R85.1 U7.7(Y2)
A4Y3: J1.D1 R131.1 U7.6(Y3)
A4Y4: J1.D2 R148.1 U7.5(Y4)
A4Y5: J1.D3 R130.1 U7.4(Y5)
A4Y6: J1.D4 R147.1 U7.3(Y6)
A4Y7: J1.D5 R129.1 U7.2(Y7)
A4Y8: J1.D6 R146.1 U7.23(Y8)
A4Y9: J1.D7 R128.1 U7.22(Y9)
A4Y10: J1.D8 R145.1 U7.21(Y10)
A4Y11: J1.D9 R127.1 U7.20(Y11)
A4Y12: J1.D10 R144.1 U7.19(Y12)
A4Y13: J1.D11 R126.1 U7.18(Y13)
A4Y14: J1.D12 R143.1 U7.17(Y14)
A4Y15: J1.D13 R125.1 U7.16(Y15)
A5_ENABLE: R254.1 U11.15(/E)
A5_Z_MCU: R119.1 U10.5(C1RX/RF0)
A5Y0: J1.D14 R142.1 U11.9(Y0)
A5Y1: J1.D15 R124.1 U11.8(Y1)
A5Y2: J1.D16 R141.1 U11.7(Y2)
A5Y3: J1.D17 R123.1 U11.6(Y3)
A5Y4: J1.E1 R170.1 U11.5(Y4)
A5Y5: J1.E2 R187.1 U11.4(Y5)
A5Y6: J1.E3 R169.1 U11.3(Y6)
A5Y7: J1.E4 R186.1 U11.2(Y7)
A5Y8: J1.E5 R168.1 U11.23(Y8)
A5Y9: J1.E6 R185.1 U11.22(Y9)
A5Y10: J1.E7 R167.1 U11.21(Y10)
A5Y11: J1.E8 R184.1 U11.20(Y11)
A5Y12: J1.E9 R166.1 U11.19(Y12)
A5Y13: J1.E10 R183.1 U11.18(Y13)
A5Y14: J1.E11 R165.1 U11.17(Y14)
A5Y15: J1.E12 R182.1 U11.16(Y15)
A6_ENABLE: R246.1 U12.15(/E)
A6_Z_MCU: R120.1 U10.9(PWM3L/RE4)
A6Y0: J1.E13 R164.1 U12.9(Y0)
A6Y1: J1.E14 R181.1 U12.8(Y1)
A6Y2: J1.E15 R163.1 U12.7(Y2)
A6Y3: J1.E16 R180.1 U12.6(Y3)
A6Y4: J1.F1 R203.1 U12.5(Y4)
A6Y5: J1.F2 R227.1 U12.4(Y5)
A6Y6: J1.F3 R202.1 U12.3(Y6)
A6Y7: J1.F4 R226.1 U12.2(Y7)
A6Y8: J1.F5 R201.1 U12.23(Y8)
A6Y9: J1.F6 R225.1 U12.22(Y9)
A6Y10: J1.F7 R200.1 U12.21(Y10)
A6Y11: J1.F8 R224.1 U12.20(Y11)
A6Y12: J1.F9 R199.1 U12.19(Y12)
A6Y13: J1.F10 R223.1 U12.18(Y13)
A6Y14: J1.F11 R198.1 U12.17(Y14)
A6Y15: J1.F12 R222.1 U12.16(Y15)
A7_ENABLE: R255.2 U15.15(/E)
A7_Z_MCU: R159.1 U10.14(PWM1H/RE1)
A7Y0: J1.F13 R197.1 U15.9(Y0)
A7Y1: J1.F14 R221.1 U15.8(Y1)
A7Y2: J1.F15 R196.1 U15.7(Y2)
A7Y3: J1.F16 R220.1 U15.6(Y3)
A7Y4: J1.G1 R276.1 U15.5(Y4)
A7Y5: J1.G2 R292.1 U15.4(Y5)
A7Y6: J1.G3 R275.1 U15.3(Y6)
A7Y7: J1.G4 R291.1 U15.2(Y7)
A7Y8: J1.G5 R274.1 U15.23(Y8)
A7Y9: J1.G6 R290.1 U15.22(Y9)
A7Y10: J1.G7 R273.1 U15.21(Y10)
A7Y11: J1.G8 R289.1 U15.20(Y11)
A7Y12: J1.G9 R272.1 U15.19(Y12)
A7Y13: J1.G10 R288.1 U15.18(Y13)
A7Y14: J1.G11 R271.1 U15.17(Y14)
A7Y15: J1.G12 R287.1 U15.16(Y15)
A8_ENABLE: R247.2 U16.15(/E)
A8_Z_MCU: R160.1 U10.10(PWM2H/RE3)
A8Y0: J1.G13 R270.1 U16.9(Y0)
A8Y1: J1.G14 R286.1 U16.8(Y1)
A8Y2: J1.G15 R269.1 U16.7(Y2)
A8Y3: J1.G16 R285.1 U16.6(Y3)
AS0: R236.1 U2.10(S0) U3.10(S0) U6.10(S0) U7.10(S0) U11.10(S0) U12.10(S0) U15.10(S0) U16.10(S0)
AS1: R238.1 U2.11(S1) U3.11(S1) U6.11(S1) U7.11(S1) U11.11(S1) U12.11(S1) U15.11(S1) U16.11(S1)
AS2: R241.1 U2.14(S2) U3.14(S2) U6.14(S2) U7.14(S2) U11.14(S2) U12.14(S2) U15.14(S2) U16.14(S2)
AS3: R243.1 U2.13(S3) U3.13(S3) U6.13(S3) U7.13(S3) U11.13(S3) U12.13(S3) U15.13(S3) U16.13(S3)
B1_ENABLE: R260.1 U4.15(/E)
B1_Z_MCU: R39.1 U10.22(AN3/INDX/CN5/RB3)
B1Y0: J2.A1 R10.1 U4.9(Y0)
B1Y1: J2.A2 R27.1 U4.8(Y1)
B1Y2: J2.A3 R11.1 U4.7(Y2)
B1Y3: J2.A4 R28.1 U4.6(Y3)
B1Y4: J2.A5 R12.1 U4.5(Y4)
B1Y5: J2.A6 R29.1 U4.4(Y5)
B1Y6: J2.A7 R13.1 U4.3(Y6)
B1Y7: J2.A8 R30.1 U4.2(Y7)
B1Y8: J2.A9 R14.1 U4.23(Y8)
B1Y9: J2.A10 R31.1 U4.22(Y9)
B1Y10: J2.A11 R15.1 U4.21(Y10)
B1Y11: J2.A12 R32.1 U4.20(Y11)
B1Y12: J2.A13 R16.1 U4.19(Y12)
B1Y13: J2.A14 R33.1 U4.18(Y13)
B1Y14: J2.A15 R17.1 U4.17(Y14)
B1Y15: J2.A16 R34.1 U4.16(Y15)
B2_ENABLE: R252.1 U5.15(/E)
B2_Z_MCU: R40.1 U10.20(EMUC3/AN1/VREF-/CN3/RB1)
B2Y0: J2.A17 R18.1 U5.9(Y0)
B2Y1: J2.B1 R50.1 U5.8(Y1)
B2Y2: J2.B2 R67.1 U5.7(Y2)
B2Y3: J2.B3 R51.1 U5.6(Y3)
B2Y4: J2.B4 R68.1 U5.5(Y4)
B2Y5: J2.B5 R52.1 U5.4(Y5)
B2Y6: J2.B6 R69.1 U5.3(Y6)
B2Y7: J2.B7 R53.1 U5.2(Y7)
B2Y8: J2.B8 R70.1 U5.23(Y8)
B2Y9: J2.B9 R54.1 U5.22(Y9)
B2Y10: J2.B10 R71.1 U5.21(Y10)
B2Y11: J2.B11 R55.1 U5.20(Y11)
B2Y12: J2.B12 R72.1 U5.19(Y12)
B2Y13: J2.B13 R56.1 U5.18(Y13)
B2Y14: J2.B14 R73.1 U5.17(Y14)
B2Y15: J2.B15 R57.1 U5.16(Y15)
B3_ENABLE: R261.2 U8.15(/E)
B3_Z_MCU: R83.1 U10.23(AN4/QEA/IC7/CN6/RB4)
B3Y0: J2.B16 R74.1 U8.9(Y0)
B3Y1: J2.B17 R58.1 U8.8(Y1)
B3Y2: J2.C1 R94.1 U8.7(Y2)
B3Y3: J2.C2 R111.1 U8.6(Y3)
B3Y4: J2.C3 R95.1 U8.5(Y4)
B3Y5: J2.C4 R112.1 U8.4(Y5)
B3Y6: J2.C5 R96.1 U8.3(Y6)
B3Y7: J2.C6 R113.1 U8.2(Y7)
B3Y8: J2.C7 R97.1 U8.23(Y8)
B3Y9: J2.C8 R114.1 U8.22(Y9)
B3Y10: J2.C9 R98.1 U8.21(Y10)
B3Y11: J2.C10 R115.1 U8.20(Y11)
B3Y12: J2.C11 R99.1 U8.19(Y12)
B3Y13: J2.C12 R116.1 U8.18(Y13)
B3Y14: J2.C13 R100.1 U8.17(Y14)
B3Y15: J2.C14 R117.1 U8.16(Y15)
B4_ENABLE: R253.2 U9.15(/E)
B4_Z_MCU: R84.1 U10.25(AN6/OCFA/RB6)
B4Y0: J2.C15 R101.1 U9.9(Y0)
B4Y1: J2.C16 R118.1 U9.8(Y1)
B4Y2: J2.C17 R102.1 U9.7(Y2)
B4Y3: J2.D1 R132.1 U9.6(Y3)
B4Y4: J2.D2 R149.1 U9.5(Y4)
B4Y5: J2.D3 R133.1 U9.4(Y5)
B4Y6: J2.D4 R150.1 U9.3(Y6)
B4Y7: J2.D5 R134.1 U9.2(Y7)
B4Y8: J2.D6 R151.1 U9.23(Y8)
B4Y9: J2.D7 R135.1 U9.22(Y9)
B4Y10: J2.D8 R152.1 U9.21(Y10)
B4Y11: J2.D9 R136.1 U9.20(Y11)
B4Y12: J2.D10 R153.1 U9.19(Y12)
B4Y13: J2.D11 R137.1 U9.18(Y13)
B4Y14: J2.D12 R154.1 U9.17(Y14)
B4Y15: J2.D13 R138.1 U9.16(Y15)
B5_ENABLE: R256.1 U13.15(/E)
B5_Z_MCU: R121.1 U10.21(AN2/~{SS1}/CN4/RB2)
B5Y0: J2.D14 R155.1 U13.9(Y0)
B5Y1: J2.D15 R139.1 U13.8(Y1)
B5Y2: J2.D16 R156.1 U13.7(Y2)
B5Y3: J2.D17 R140.1 U13.6(Y3)
B5Y4: J2.E1 R171.1 U13.5(Y4)
B5Y5: J2.E2 R188.1 U13.4(Y5)
B5Y6: J2.E3 R172.1 U13.3(Y6)
B5Y7: J2.E4 R189.1 U13.2(Y7)
B5Y8: J2.E5 R173.1 U13.23(Y8)
B5Y9: J2.E6 R190.1 U13.22(Y9)
B5Y10: J2.E7 R174.1 U13.21(Y10)
B5Y11: J2.E8 R191.1 U13.20(Y11)
B5Y12: J2.E9 R175.1 U13.19(Y12)
B5Y13: J2.E10 R192.1 U13.18(Y13)
B5Y14: J2.E11 R176.1 U13.17(Y14)
B5Y15: J2.E12 R193.1 U13.16(Y15)
B6_ENABLE: R248.1 U14.15(/E)
B6_Z_MCU: R122.1 U10.19(EMUD3/AN0/VREF+/CN2/RB0)
B6Y0: J2.E13 R177.1 U14.9(Y0)
B6Y1: J2.E14 R194.1 U14.8(Y1)
B6Y2: J2.E15 R178.1 U14.7(Y2)
B6Y3: J2.E16 R195.1 U14.6(Y3)
B6Y4: J2.F1 R204.1 U14.5(Y4)
B6Y5: J2.F2 R228.1 U14.4(Y5)
B6Y6: J2.F3 R205.1 U14.3(Y6)
B6Y7: J2.F4 R229.1 U14.2(Y7)
B6Y8: J2.F5 R206.1 U14.23(Y8)
B6Y9: J2.F6 R230.1 U14.22(Y9)
B6Y10: J2.F7 R207.1 U14.21(Y10)
B6Y11: J2.F8 R231.1 U14.20(Y11)
B6Y12: J2.F9 R208.1 U14.19(Y12)
B6Y13: J2.F10 R232.1 U14.18(Y13)
B6Y14: J2.F11 R209.1 U14.17(Y14)
B6Y15: J2.F12 R233.1 U14.16(Y15)
B7_ENABLE: R257.2 U17.15(/E)
B7_Z_MCU: R161.1 U10.24(AN5/QEB/IC8/CN7/RB5)
B7Y0: J2.F13 R210.1 U17.9(Y0)
B7Y1: J2.F14 R234.1 U17.8(Y1)
B7Y2: J2.F15 R211.1 U17.7(Y2)
B7Y3: J2.F16 R235.1 U17.6(Y3)
B7Y4: J2.G1 R277.1 U17.5(Y4)
B7Y5: J2.G2 R293.1 U17.4(Y5)
B7Y6: J2.G3 R278.1 U17.3(Y6)
B7Y7: J2.G4 R294.1 U17.2(Y7)
B7Y8: J2.G5 R279.1 U17.23(Y8)
B7Y9: J2.G6 R295.1 U17.22(Y9)
B7Y10: J2.G7 R280.1 U17.21(Y10)
B7Y11: J2.G8 R296.1 U17.20(Y11)
B7Y12: J2.G9 R281.1 U17.19(Y12)
B7Y13: J2.G10 R297.1 U17.18(Y13)
B7Y14: J2.G11 R282.1 U17.17(Y14)
B7Y15: J2.G12 R298.1 U17.16(Y15)
B8_ENABLE: R249.2 U18.15(/E)
B8_Z_MCU: R162.1 U10.26(AN7/RB7)
B8Y0: J2.G13 R283.1 U18.9(Y0)
B8Y1: J2.G14 R299.1 U18.8(Y1)
B8Y2: J2.G15 R284.1 U18.7(Y2)
B8Y3: J2.G16 R300.1 U18.6(Y3)
BS0: R237.1 U4.10(S0) U5.10(S0) U8.10(S0) U9.10(S0) U13.10(S0) U14.10(S0) U17.10(S0) U18.10(S0)
BS1: R240.1 U4.11(S1) U5.11(S1) U8.11(S1) U9.11(S1) U13.11(S1) U14.11(S1) U17.11(S1) U18.11(S1)
BS2: R242.1 U4.14(S2) U5.14(S2) U8.14(S2) U9.14(S2) U13.14(S2) U14.14(S2) U17.14(S2) U18.14(S2)
BS3: R244.1 U4.13(S3) U5.13(S3) U8.13(S3) U9.13(S3) U13.13(S3) U14.13(S3) U17.13(S3) U18.13(S3)
BUTTON1: C28.1 R158.1 SW1.1 SW1.3 U10.36(~{FLTA}/INT0/RE8)
BUTTON2: C29.1 R179.1 SW2.1 SW2.3 U10.37(EMUD2/OC2/IC2/INT2/RD1)
CNN_D_N: J3.2(D-) R301.2
CNN_D_P: J3.3(D+) R302.2
LED1: R76.2 U10.27(AN8/RB8)
LED2: R77.2 U10.32(EMUD1/SOSCI/T2CK/U1ATX/CN1/RC13)
LED3: R78.2 U10.35(EMUC1/SOSCO/T1CK/U1ARX/CN0/RC14)
LED4: R79.2 U10.38(OC4/RD3)
LED5: R80.2 U10.41(OC3/RD2)
MCLR: ICSP_1.1 R157.2 U10.18(~{MCLR})
OSC1: C18.1 U10.30(OSC1/CLKI) X1.2
OSC2: C23.1 U10.31(OSC2/CLKO/RC15) X1.1
PGC: ICSP_1.5 R262.1 U10.1(PGC/EMUC/U1RX/SDI1/SDA/RF2)
PGD: ICSP_1.4 R218.1 U10.44(PGD/EMUD/U1TX/SDO1/SCL/RF3)
SCL1_MCU: R213.2 R218.2 R219.2 U19.22(SCL)
SCL2_MCU: R239.2 U10.42(EMUC2/OC1/IC1/INT1/RD0)
SDA1_MCU: R212.2 R262.2 R263.2 U19.23(SDA)
SDA2_MCU: R265.2 U10.43(SCK1/RF6)
U2RX_MCU: R264.2 U10.3(U2RX/CN17/RF4)
U2TX_MCU: R266.2 U10.2(U2TX/CN18/RF5)
USBD_N: R301.1 U21.16(USBDM)
USBD_P: R302.1 U21.15(USBDP)
NetC1_1: C1.1 C2.1 D1.K U1.1(+VIN)
NetC7_1: C7.1 C8.1 L1.2 R35.2 R36.2 U1.4(FB)
NetD1_A: D1.A JDC1.1(T)
NetD2_K: D2.K L1.1 U1.2(OUTPUT)
NetPOWER1_2: POWER1.2 R36.1
NetPOWER2_2: POWER2.2 R76.1
NetPOWER3_2: POWER3.2 R77.1
NetPOWER4_2: POWER4.2 R78.1
NetPOWER5_2: POWER5.2 R79.1
NetPOWER6_2: POWER6.2 R80.1
NetPOWER7_1: POWER7.1 U21.23(CBUS0)
NetPOWER7_2: POWER7.2 R267.1
NetPOWER8_1: POWER8.1 U21.22(CBUS1)
NetPOWER8_2: POWER8.2 R268.1
NetR37_2: R37.2 U2.1(Z)
NetR38_2: R38.2 U3.1(Z)
NetR39_2: R39.2 U4.1(Z)
NetR40_2: R40.2 U5.1(Z)
NetR81_2: R81.2 U6.1(Z)
NetR82_2: R82.2 U7.1(Z)
NetR83_2: R83.2 U8.1(Z)
NetR84_2: R84.2 U9.1(Z)
NetR119_2: R119.2 U11.1(Z)
NetR120_2: R120.2 U12.1(Z)
NetR121_2: R121.2 U13.1(Z)
NetR122_2: R122.2 U14.1(Z)
NetR159_2: R159.2 U15.1(Z)
NetR160_2: R160.2 U16.1(Z)
NetR161_2: R161.2 U17.1(Z)
NetR162_2: R162.2 U18.1(Z)
NetR214_2: R214.2 R263.1 R265.1 U20.23(SDA)
NetR215_2: R215.2 R219.1 R239.1 U20.22(SCL)
NetR216_1: R216.1 U19.1(~{INT})
NetR217_1: R217.1 U20.1(~{INT})
NetR236_2: R236.2 U19.4(IO0_0)
NetR237_2: R237.2 U20.4(IO0_0)
NetR238_2: R238.2 U19.5(IO0_1)
NetR240_2: R240.2 U20.5(IO0_1)
NetR241_2: R241.2 U19.6(IO0_2)
NetR242_2: R242.2 U20.6(IO0_2)
NetR243_2: R243.2 U19.7(IO0_3)
NetR244_2: R244.2 U20.7(IO0_3)
NetR246_2: R246.2 U19.8(IO0_4)
NetR247_1: R247.1 U19.17(IO1_4)
NetR248_2: R248.2 U20.8(IO0_4)
NetR249_1: R249.1 U20.17(IO1_4)
NetR250_2: R250.2 U19.9(IO0_5)
NetR251_1: R251.1 U19.18(IO1_5)
NetR252_2: R252.2 U20.9(IO0_5)
NetR253_1: R253.1 U20.18(IO1_5)
NetR254_2: R254.2 U19.10(IO0_6)
NetR255_1: R255.1 U19.19(IO1_6)
NetR256_2: R256.2 U20.10(IO0_6)
NetR257_1: R257.1 U20.19(IO1_6)
NetR258_2: R258.2 U19.11(IO0_7)
NetR259_1: R259.1 U19.20(IO1_7)
NetR260_2: R260.2 U20.11(IO0_7)
NetR261_1: R261.1 U20.20(IO1_7)
NetR264_1: R264.1 U21.1(TXD)
NetR266_1: R266.1 U21.5(RXD)

Not connected (* = marked no-connect by the designer): J3 4(ID)*; U10 12(NC)* 13(NC)* 33(NC)* 34(NC)*; U16 2(Y7)* 3(Y6)* 4(Y5)* 5(Y4)* 16(Y15)* 17(Y14)* 18(Y13)* 19(Y12)* 20(Y11)* 21(Y10)* 22(Y9)* 23(Y8)*; U18 2(Y7)* 3(Y6)* 4(Y5)* 5(Y4)* 16(Y15)* 17(Y14)* 18(Y13)* 19(Y12)* 20(Y11)* 21(Y10)* 22(Y9)* 23(Y8)*; U19 13(IO1_0)* 14(IO1_1)* 15(IO1_2)* 16(IO1_3)*; U20 13(IO1_0)* 14(IO1_1)* 15(IO1_2)* 16(IO1_3)*; U21 2(~{DTR})* 3(~{RTS})* 6(~{RI})* 8(NC)* 9(~{DSR})* 10(~{DCD})* 11(~{CTS})* 12(CBUS4)* 13(CBUS2)* 14(CBUS3)* 19(~{RESET})* 24(NC)* 27(OSCI)* 28(OSCO)*; VIT1 VIT1(1)*; VIT2 VIT1(1)*; VIT3 VIT1(1)*; VIT4 VIT1(1)*

## Layout directives
differential pair: CNN_D_N, CNN_D_P, USBD_N, USBD_P

## Notes on the sheet
- Labels drawn without touching a wire or pin: DRIVER, MCU, POWER SUPPLY, SENSE, USB TO UART
- (in symbol DC10A) +DC; -DC

## Library data of the parts
C1 C8 = CAP_SMD
C2-C7 C9-C35 = 239: CAP CER 22UF 10V X5R 0603; Process Type: SMT; Type: CAP; Packaging: Tape and Reel
  C2 C7 C14-C17 C33-C35: Value: 100nF
  C3-C6 C9-C13 C19-C22 C24-C27 C30-C32: Value: 1uF
  C18 C23: Value: 22pF
  C28 C29: Value: 10nF
D1 D2 = Diode 1N5822: SS34 1N5822
ICSP_1 = 3-644456-5: CONN  WIRE-BOARD 5 POSITION, 2.54 mm; Manufacturer 1: TE CONNECTIVITY / AMP; Description 1: TE CONNECTIVITY / AMP - 3-644456-5 - WIRE-BOARD CONNECTOR HEADER, 5 POSITION, 0.1IN; Product Range: MTA-100 Series; Contact Termination Type: Through Hole; Gender: Header; No. of Contacts: 5; Pitch Spacing: 2.54; No. of Rows: 1; Supplier 1: Farnell; Manufacturer Part Number 1: 3-644456-5; RoHS 1: YES; Stock 1: 4874; Pricing 1: 1=0.244, 10=0.237, 100=0.21, 500=0.205, 1000=0.197, 2000=0.191 (GBP); Contact Plating: Tin Plated Contacts; ComponentLink1URL: http://www.farnell.com/datasheets/1654097.pdf; ComponentLink1Description: http://www.farnell.com/datasheets/1654097.pdf; ComponentLink2URL: http://www.farnell.com/cad/1649959.pdf; ComponentLink2Description: http://www.farnell.com/cad/1649959.pdf; ComponentLink3URL: http://www.farnell.com/datasheets/1926653.pdf; ComponentLink3Description: http://www.farnell.com/datasheets/1926653.pdf; Supplier Part Number 1: 1374535
J3 = CNN_67503-1020: USB, MINI, SMD, RA KME04-USBMU03A01; Manufacturer: Molex; ComponentLink1URL: http://www.molex.com/; PartNumber: 67503-1020; Mounting Technology: Surface Mount; ComponentLink1Description: Manufacturer URL; Terminal Pitch: 0.8 mm; DatasheetVersion: Rev F, 06/2009; ComponentLink2Description: Datasheet; PackageDescription: Mini USB Connector, SMT, Righer Angle; ComponentLink2URL: http://www.molex.com/pdm_docs/sd/675031020_sd.pdf; PackageReference: 67503-1020
JDC1 = DC10A: CLIFF ELECTRONIC COMPONENTS - DC10A - SOCKET, PCB, DC POWER, 2.1MM, PK10; Product Range: DC Series; Gender: Receptacle; Voltage Rating: 12; Current Rating: 5; Connector Mounting: PCB Mount; Contact Termination Type: Solder; SVHC: No SVHC (15-Jun-2015); External Depth: 14.6; External Length / Height: 11; External Width: 9; Supplier 1: Farnell; Supplier Part Number 1: 224959; Manufacturer 1: CLIFF ELECTRONIC COMPONENTS; Manufacturer Part Number 1: DC10A; RoHS 1: YES; Description 1: CLIFF ELECTRONIC COMPONENTS - DC10A - SOCKET, PCB, DC POWER, 2.1MM, PK10; Stock 1: 2465; Pricing 1: 10=0.657, 100=0.589, 250=0.538, 500=0.516, 1000=0.502 (GBP); Contact Termination: Solder; Mounting Type: PCB Through Hole; Operating Temperature Max: 80; Operating Temperature Min: -20; Termination Method: Solder<!--FANDB--><div class="features-and-benefits-container"></div>; ComponentLink1URL: http://www.farnell.com/datasheets/317160.pdf; ComponentLink1Description: http://www.farnell.com/datasheets/317160.pdf
L1 = Inductor
POWER1-POWER8 = 150080SS75000: LED, 0805, RED, 0805; Manufacturer 1: WURTH ELEKTRONIK; Description 1: WURTH ELEKTRONIK - 150080SS75000 - LED, 0805, SUP RED, 60MCD, 630NM; Supplier 1: Farnell; Manufacturer Part Number 1: 150080SS75000; RoHS 1: YES; Stock 1: 1235; Pricing 1: 1=0.114, 50=0.0994, 100=0.0849, 500=0.0765, 2000=0.0683, 4000=0.0612, 20000=0.0589, 40000=0.0574 (GBP); ComponentLink1URL: http://www.farnell.com/datasheets/1911351.pdf; ComponentLink1Description: http://www.farnell.com/datasheets/1911351.pdf; Supplier Part Number 1: 2322078
R1-R302 = 71: RES 0 OHM JUMPER 1/16W 0603; Process Type: SMT; Tolerance: Jumper; Type: RES; Packaging: Tape and Reel
  R1-R34 R41-R74 R85-R118 R123-R156 R163-R178 R180-R211 R220-R235 R269-R300: NI_MARK: *; Package: 0603; Power Rating: 1/16W; Value: 100K
  R35 R75 R239 R245 R264-R266: NI_MARK: *; Value: 0
  R36 R76-R80 R157 R212-R217 R267 R268: NI_MARK: *; Value: 1.2K
  R37-R40 R81-R84 R119-R122 R159-R162 R218 R236-R238 R240-R244 R246-R262: NI_MARK: *; Value: 100R
  R158 R179: NI_MARK: *; Package: 0603; Power Rating: 1/16W; Value: 10K
  R219 R263: Value: 0
  R301 R302: NI_MARK: *; Value: 22R
SW1 SW2 = SW4: Switch button 4 pin; Value: Button chip 4 pin
U2-U9 U11-U18 = 74HC4067PW,118: Description; Manufacturer_Name: Nexperia; Copyright: Copyright (C) 2025 Ultra Librarian. All rights reserved.; Manufacturer_Part_Number: 74HC4067PW,118; RefDes: RefDes; Type: Type
U10 = DSPIC30F4011-30I/PT: MICROCHIP - DSPIC30F4011-30I/PT - DSC, 32BIT, 120MHZ, 48KB, 5.5V, TQFP-44; Supplier 1: Farnell; Manufacturer 1: MICROCHIP; Manufacturer Part Number 1: DSPIC30F4011-30I/PT; RoHS 1: YES; Description 1: MICROCHIP - DSPIC30F4011-30I/PT - DSC, 32BIT, 120MHZ, 48KB, 5.5V, TQFP-44; Stock 1: 229; Pricing 1: 1=4.37, 10=3.3, 100=3.01 (GBP); ComponentLink1URL: http://bcove.me/sxutsrzp; ComponentLink1Description: http://bcove.me/sxutsrzp; ComponentLink2URL: http://www.farnell.com/datasheets/1669385.pdf; ComponentLink2Description: http://www.farnell.com/datasheets/1669385.pdf; Supplier Part Number 1: 2315935
U19 U20 = PCA9555PW: 16-bit 2.3- to 5.5-V I2C/SMBus I/O expander with interrupt, weak pull-up & config registers; MF: Texas Instruments; SnapEDA_Link: https://www.snapeda.com/parts/PCA9555PW/Texas+Instruments/view-part/?ref=snap; Package: TSSOP-24 Texas Instruments; Value: *; MP: PCA9555PW; Check_prices: https://www.snapeda.com/parts/PCA9555PW/Texas+Instruments/view-part/?ref=eda
U21 = FT232RL: IC USB FS SERIAL UART 28-SSOP; Data Rate: 12Mbps; Max Supply Voltage: 5.25V; Operating Supply Current: 15mA; Number of Channels: 1; Voltage: 5V; Min Supply Voltage: 3.3V; Radiation Hardening: No; Mount: Surface Mount; Min Operating Temperature: -40°C; Package Quantity: 2000; Number of Transceivers: 1; Width: 5.3mm; Number of Pins: 28; Height: 1.75mm; Weight: 0.080001oz; Lead Free: Lead Free; Length: 10.2mm; REACH SVHC: No SVHC; Max Operating Temperature: 85°C; Packaging: Tape and Reel; Interface: UART; Case/Package: SSOP
VIT1-VIT4 = VIT: Oc Vit
X1 = FOXSLF/073-20: CRYSTAL, 7.3728MHZ, 20PF; Manufacturer 1: FOX ELECTRONICS; Description 1: FOX ELECTRONICS - FOXSLF/073-20 - CRYSTAL, 7.3728MHZ, 20PF; Product Range: HC49; Frequency Nom: 7.3728; Frequency Stability + / -: 50; Frequency Tolerance + / -: 30; Crystal Case: Through Hole, 11.35mm x 4.65; Load Capacitance: 20; SVHC: No SVHC (15-Jun-2015); Crystal Mounting Type: Through Hole; Frequency Stability: ± 50; No. of Pins: 2; Supplier 1: Farnell; Supplier Part Number 1: 2063944; Manufacturer Part Number 1: FOXSLF/073-20; RoHS 1: YES; Stock 1: 347; Pricing 1: 1=0.36, 10=0.315, 100=0.254, 250=0.24, 500=0.214, 2000=0.15, 6000=0.142, 20000=0.139 (GBP); Operating Temperature Min: -20; Operating Temperature Max: 70; Frequency: 7.3728; MSL: MSL 1 - Unlimited; Operating Temperature Range: -20°C to +70; ComponentLink1URL: http://www.farnell.com/datasheets/1911270.pdf; ComponentLink1Description: http://www.farnell.com/datasheets/1911270.pdf